# Altium schematic sheet digital.schdoc
size A3
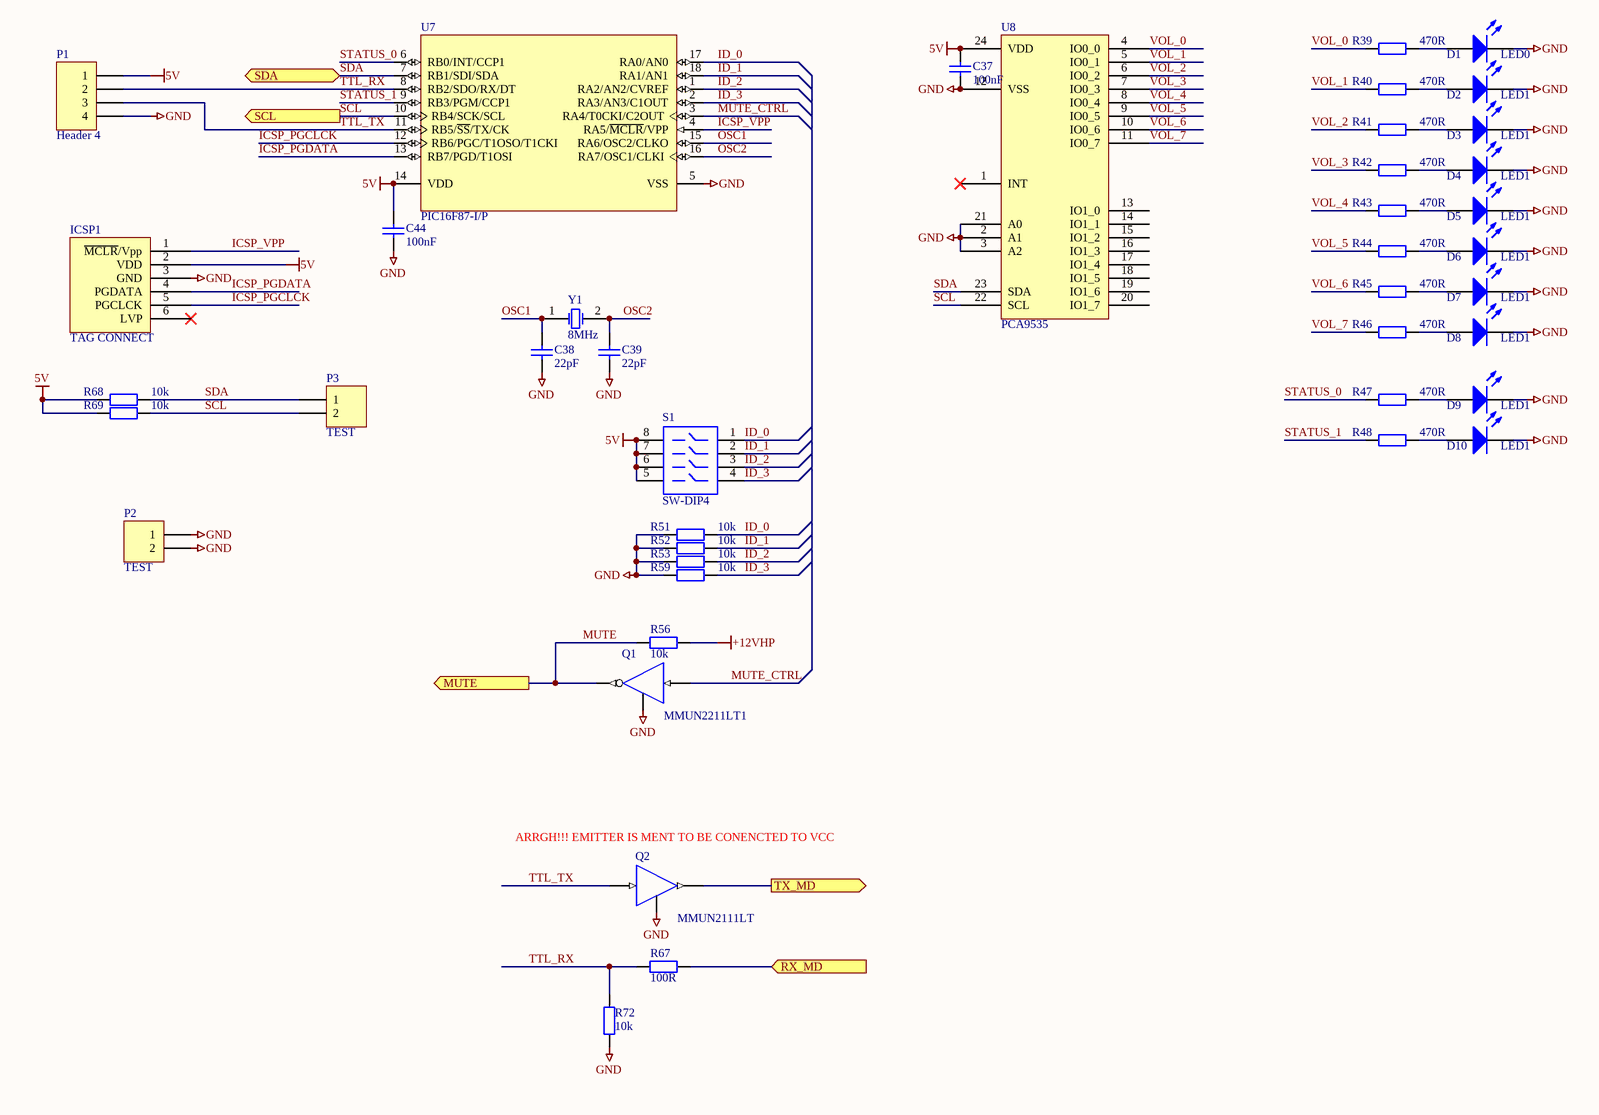
[diagram p0: digital.schdoc]

## Parts
C37  100nF  [CAP (3D) - 0603]
C38  22pF  [CAP (3D) - 0603]
C39  22pF  [CAP (3D) - 0603]
C44  100nF  [CAP (3D) - 0603]
D1  LED0  [LED 3MM]
D2  LED1  [LED 3MM]
D3  LED1  [LED 3MM]
D4  LED1  [LED 3MM]
D5  LED1  [LED 3MM]
D6  LED1  [LED 3MM]
D7  LED1  [LED 3MM]
D8  LED1  [LED 3MM]
D9  LED1  [LED 3MM]
D10  LED1  [LED 3MM]
ICSP1  TAG CONNECT  [ICSP - TAG CONNECT TYPE2]
P1  Header 4  [HDR1X4]
P2  TEST  [HDR1X2]
P3  TEST  [HDR1X2]
Q1  MMUN2211LT1  [SOT23-3L]
Q2  MMUN2111LT  [SOT23-3L]
R39  470R  [RES (3D) - 0603]
R40  470R  [RES (3D) - 0603]
R41  470R  [RES (3D) - 0603]
R42  470R  [RES (3D) - 0603]
R43  470R  [RES (3D) - 0603]
R44  470R  [RES (3D) - 0603]
R45  470R  [RES (3D) - 0603]
R46  470R  [RES (3D) - 0603]
R47  470R  [RES (3D) - 0603]
R48  470R  [RES (3D) - 0603]
R51  10k  [RES (3D) - 0603]
R52  10k  [RES (3D) - 0603]
R53  10k  [RES (3D) - 0603]
R56  10k  [RES (3D) - 0603]
R59  10k  [RES (3D) - 0603]
R67  100R  [RES (3D) - 0603]
R68  10k  [RES (3D) - 0603]
R69  10k  [RES (3D) - 0603]
R72  10k  [RES (3D) - 0603]
S1  SW-DIP4  [DIP-8]  (no BOM)
U7  PIC16F87-I/P  [PDIP300-18]
U8  PCA9535  [WSO24_L]
Y1  8MHz  [HC-49U]

## Ports
MUTE (out), RX_MD (in), SCL (out), SDA (bidir), TX_MD (out)

## Nets
5V: C37.2 C44.2 ICSP1.2(VDD) P1.1 R68.1 R69.1 S1.5 S1.6 S1.7 S1.8 U7.14(VDD) U8.24(VDD)
+12VHP: R56.1
GND: C37.1 C38.1 C39.1 C44.1 D1.2(K) D2.2(K) D3.2(K) D4.2(K) D5.2(K) D6.2(K) D7.2(K) D8.2(K) D9.2(K) D10.2(K) ICSP1.3(GND) P1.4 P2.1 P2.2 Q1.2(E) Q2.2(E) R51.1 R52.1 R53.1 R59.1 R72.1 U7.5(VSS) U8.2(A1) U8.3(A2) U8.12(VSS) U8.21(A0)
ICSP_PGCLCK: ICSP1.5(PGCLCK) U7.12(RB6/PGC/T1OSO/T1CKI)
ICSP_PGDATA: ICSP1.4(PGDATA) U7.13(RB7/PGD/T1OSI)
ICSP_VPP: ICSP1.1(~{MCLR}/Vpp) U7.4(RA5/~{MCLR}/VPP)
ID_0: R51.2 S1.1 U7.17(RA0/AN0)
ID_1: R52.2 S1.2 U7.18(RA1/AN1)
ID_2: R53.2 S1.3 U7.1(RA2/AN2/CVREF)
ID_3: R59.2 S1.4 U7.2(RA3/AN3/C1OUT)
MUTE: Q1.3(C) R56.2 ; port MUTE
MUTE_CTRL: Q1.1(B) U7.3(RA4/T0CKI/C2OUT)
OSC1: C38.2 U7.15(RA6/OSC2/CLKO) Y1.1(OSC1)
OSC2: C39.2 U7.16(RA7/OSC1/CLKI) Y1.2(OSC2)
RX_MD: R67.2 ; port RX_MD
SCL: P3.2 R69.2 U7.10(RB4/SCK/SCL) U8.22(SCL) ; port SCL
SDA: P3.1 R68.2 U7.7(RB1/SDI/SDA) U8.23(SDA) ; port SDA
STATUS_0: R47.1 U7.6(RB0/INT/CCP1)
STATUS_1: R48.1 U7.9(RB3/PGM/CCP1)
TTL_RX: P1.2 R67.1 R72.2 U7.8(RB2/SDO/RX/DT)
TTL_TX: P1.3 Q2.1(B) U7.11(RB5/~{SS}/TX/CK)
TX_MD: Q2.3(C) ; port TX_MD
VOL_0: R39.1 U8.4(IO0_0)
VOL_1: R40.1 U8.5(IO0_1)
VOL_2: R41.1 U8.6(IO0_2)
VOL_3: R42.1 U8.7(IO0_3)
VOL_4: R43.1 U8.8(IO0_4)
VOL_5: R44.1 U8.9(IO0_5)
VOL_6: R45.1 U8.10(IO0_6)
VOL_7: R46.1 U8.11(IO0_7)
NetD1_1: D1.1(A) R39.2
NetD2_1: D2.1(A) R40.2
NetD3_1: D3.1(A) R41.2
NetD4_1: D4.1(A) R42.2
NetD5_1: D5.1(A) R43.2
NetD6_1: D6.1(A) R44.2
NetD7_1: D7.1(A) R45.2
NetD8_1: D8.1(A) R46.2
NetD9_1: D9.1(A) R47.2
NetD10_1: D10.1(A) R48.2

Not connected (* = marked no-connect by the designer): ICSP1 6(LVP)*; U8 1(INT)* 13(IO1_0) 14(IO1_1) 15(IO1_2) 16(IO1_3) 17(IO1_4) 18(IO1_5) 19(IO1_6) 20(IO1_7)

## Notes on the sheet
- (near Q2) ARRGH!!! EMITTER IS MENT TO BE CONENCTED TO VCC

## Library data of the parts
C37 C44 = Cap: Capacitor; Manufacturer: YAEGO; Manufacturer Part No.: CC0603ZRY5V9BB104; Value: 100nF; Mouser Part no.: 603-C0603ZRY5V9BB104; Web link: http://au.mouser.com/ProductDetail/Yageo/CC0603ZRY5V9BB104/?qs=AgBp2OyFlx%252bk1xe0tOfw5lSGBXIDidlPHbEeepmuVSw%3d; Supplier 1: Mouser; Supplier 2: Digi-Key; Supplier Part Number 1: 603-C0603ZRY5V9BB104; Supplier Part Number 2: 311-1343-2-ND
C38 C39 = Cap: Capacitor; Manufacturer: XICON; Manufacturer Part No.: 140-CC504N220J-RC; Value: 22pF; Mouser Part No.: 140-CC504N220J-RC; Web Link: http://au.mouser.com/ProductDetail/Xicon/140-CC504N220J-RC/?qs=0ZUpllj3bsYzruu%2fcoq7vTMVNT1WtLd%2fpuK8loL2Z54%3d; Supplier 1: Mouser; Supplier Part Number 1: 810-CGA3E2C0G1H220J; Supplier 2: Digi-Key; Supplier Part Number 2: 445-4659-1-ND
D1 = LED0: Typical INFRARED GaAs LED; Manufacturer: VISHAY; Manufacturer Part No.: TLUR4401; Value: 5mm RED; Mouser Part No.: 78-TLUR4401; Web Link: http://au.mouser.com/ProductDetail/Vishay-Semiconductors/TLUR4401/?qs=wPfJvkPQFIx0FPogkG3Rk17kK5izA6tzHCIdzMGswXQ%3d
D2 = LED1: Typical RED GaAs LED; Manufacturer: VISHAY; Manufacturer Part No.: TLHE4600; Value: 5mm Yellow; Mouser Part No.: 78-TLHE4600; Web Link: http://au.mouser.com/ProductDetail/Vishay-Semiconductors/TLHE4600/?qs=%2fjqivxn91cfR0QvyUZMNU9A%2fAGcwtLVHZCHJgVoNs1k%3d
D3-D8 = LED1: Typical RED GaAs LED; Manufacturer: VISHAY; Manufacturer Part No.: TLHG4405; Value: 5mm GREEN; Mouser Part No.: 78-TLHG4405; Web Link: http://au.mouser.com/ProductDetail/Vishay-Semiconductors/TLHG4405/?qs=%2fjqivxn91ceXQHLEqPKOGEAVX9AVRiAwFz0xjELkLgQ%3d
D9 D10 = LED1: Typical RED GaAs LED; Manufacturer: VISHAY; Manufacturer Part No.: TLHB4400; Value: 5mm BLUE; Mouser Part No.: 78-TLHB4400; Web Link: http://au.mouser.com/ProductDetail/Vishay-Semiconductors/TLHB4400/?qs=Ymhh3MYumTk3eLVnr%2fL8z9qvLxshKLWmjpIB0Dh4Pzg%3d
ICSP1 = ICSP - TAG CONNECT: Manufacturer: N/A - PCB ARTWORK; Manufacturer Part No.: N/A; Mouser Part no.: N/A; Web link: N/A - PCB ARTWORK
P1 = Header 4: Header, 4-Pin; Manufacturer: NA PCB ARTWORK; Manufacturer Part No.: NA PCB ARTWORK; Mouser Part No.: NA PCB ARTWORK; Web Link: NA PCB ARTWORK
P2 P3 = Header 2: Header, 2-Pin; Manufacturer: NA PCB ARTWORK; value: NA PCB ARTWORK; Manufacturer Part No.: NA PCB ARTWORK; Mouser Part no.: NA PCB ARTWORK; Web link: NA PCB ARTWORK
Q1 = NPN DIGITAL TRANSISTOR: Manufacturer: ON SEMO; Manufacturer Part No.: MMUN2211LT1G; Mouser Part no.: 863-MMUN2211LT1G; Web link: http://au.mouser.com/ProductDetail/ON-Semiconductor/MMUN2211LT1G/?qs=ZpPixqFcBtyOBGnml%2fmJx1k1aPkM%252ba71PMQX%2fEUGWkQ%3d; value: MMUN2211; Supplier 1: Mouser; Supplier Part Number 1: 863-MMUN2211LT1G; Supplier 2: Digi-Key; Supplier Part Number 2: MMUN2211LT1GOSCT-ND
Q2 = PNP DIGITAL TRANSISTOR: MMUN2111LT1; Manufacturer: ON SEMI; Manufacturer Part No.: MMUN2111LT1G; Mouser Part no.: 863-MMUN2111LT1G; Web link: http://au.mouser.com/ProductDetail/ON-Semiconductor/MMUN2111LT1G/?qs=ZpPixqFcBtwQDxXftSY18HVoUlEOKOEv; value: MMUN2111; Supplier 1: Mouser; Supplier Part Number 1: 863-MMUN2111LT1G; Supplier 2: Digi-Key; Supplier Part Number 2: MMUN2111LT1GOSCT-ND
R39-R48 = Res2: Resistor; Manufacturer: YAEGO; Manufacturer Part No.: AC0603FR-07470RL; Value: 470R; Mouser Part No.: 603-AC0603FR-07470RL; Web Link: http://au.mouser.com/ProductDetail/Yageo/AC0603FR-07470RL/?qs=UoPT7wUmgYJ4U%252bu075ZTYP6sVL%2fdvPe6mRJ9iCUfaf8%3d; Supplier 1: Mouser; Supplier Part Number 1: 301-470-RC; Supplier 2: Digi-Key; Supplier Part Number 2: 311-470GRCT-ND
R51-R53 R56 R59 R68 R69 R72 = Res2: Resistor; Manufacturer: YAEGO; Manufacturer Part No.: AC0603JR-0710KL; Value: 10k; Mouser Part No.: 603-AC0603JR-0710KL; Web Link: http://au.mouser.com/ProductDetail/Yageo/AC0603JR-0710KL/?qs=cGU37fGUGy%2ffTpJnc0hqwyfRqkqml5N9cIWubNc1%2ffQ%3d; Supplier 1: Mouser; Supplier 2: Digi-Key; Supplier Part Number 1: 603-AC0603JR-0710KL; Supplier Part Number 2: 311-10KLECT-ND
R67 = Res2: Resistor; Manufacturer: YAEGO; Manufacturer Part No.: RC0603FR-07100RL; Value: 100R; Mouser Part No.: 603-RC0603FR-07100RL; Web Link: http://au.mouser.com/ProductDetail/Yageo/RC0603FR-07100RL/?qs=NEN%2fsE%2fLsvNZmJsqhL3QSPml4gnL9OhHteu5IxNdzn8%3d; Supplier 1: Mouser; Supplier 2: Digi-Key; Supplier Part Number 1: 302-100-RC; Supplier Part Number 2: RMCF0603JT100RCT-ND
S1 = SW-DIP4: DIP Switch; Manufacturer: NA PCB ARTWORK; Manufacturer Part No.: NA PCB ARTWORK; Mouser Part No.: NA PCB ARTWORK; Web Link: NA PCB ARTWORK
U7 = PIC16F87-I/P: Enhanced FLASH Microcontroller with nanoWatt Technology, 4K (x14-Bit words) FLASH, 368 Bytes RAM, 18-Pin PDIP, Standard VDD Range, Industrial Temperature; Manufacturer: MICROCHIP; Manufacturer Part No.: PIC16F87-I/P; Mouser Part No.: 579-PIC16F87-I/P; Web Link: http://au.mouser.com/ProductDetail/Microchip/PIC16F87-I-P/?qs=lQv0JY93vreTeOWEyXwAMw%3d%3d; Supplier 1: Mouser; Supplier Part Number 1: 579-PIC16F87-I/P; Supplier 2: Digi-Key; Supplier Part Number 2: PIC16F87-I/P-ND
U8 = PCA9535: PCA9535 I2C BUS 16 BIT IO EXPANDER; Manufacturer: NXP Semiconductors; Manufacturer Part No.: PCA9535D,112; value: PCA9535D,112; Mouser Part no.: 771-PCA9535D112; Web link: http://au.mouser.com/ProductDetail/NXP-Semiconductors/PCA9535D112/?qs=sGAEpiMZZMutXGli8Ay4kAfwW/5bhnYT8yEKTPxoZ0k%3d; Supplier 1: Mouser; Supplier Part Number 1: 771-PCA9535D112; Supplier 2: Digi-Key; Supplier Part Number 2: 568-8708-6-ND
Y1 = XTAL: Crystal Oscillator; Manufacturer: CTS Electronic Components; Manufacturer Part No.: ATS080B; Mouser Part No.: 774-ATS080B; Web Link: http://au.mouser.com/ProductDetail/CTS-Electronic-Components/ATS080B/?qs=EyvxYzk7Sd2aTvRJmqPlOIqSHD%252bMQgdc; Value: 8MHz; Supplier 1: Mouser; Supplier Part Number 1: 774-ATS080B; Supplier 2: Digi-Key; Supplier Part Number 2: CTX900-ND